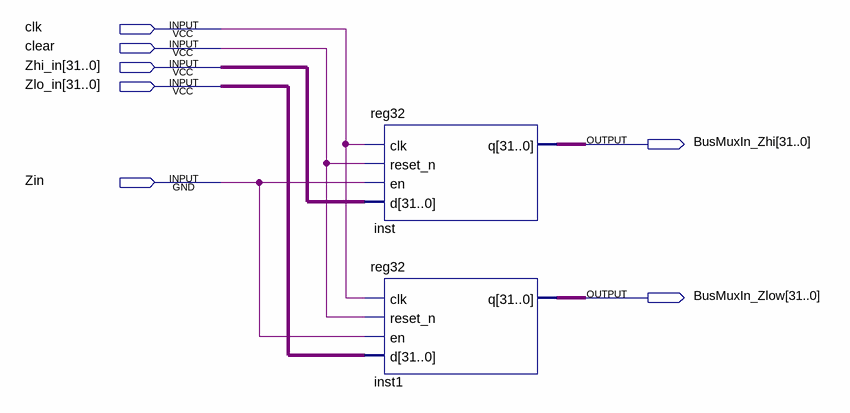
[diagram p0: schematic sheet]
// Quartus schematic z_design.bdf as structural Verilog: 2 symbols, 7 pins
module z_design (
  input  clk,
  input  clear,
  input  [31:0] Zhi_in,
  input  [31:0] Zlo_in,
  input  Zin,
  output [31:0] BusMuxIn_Zhi,
  output [31:0] BusMuxIn_Zlow
);

  reg32 inst (.clk(clk), .reset_n(clear), .en(Zin), .d(Zhi_in), .q(BusMuxIn_Zhi));
  reg32 inst1 (.clk(clk), .reset_n(clear), .en(Zin), .d(Zlo_in), .q(BusMuxIn_Zlow));
endmodule
